# EAGLE design OpenEVSE_PLUS_v4 (EAGLE 7.3.0)
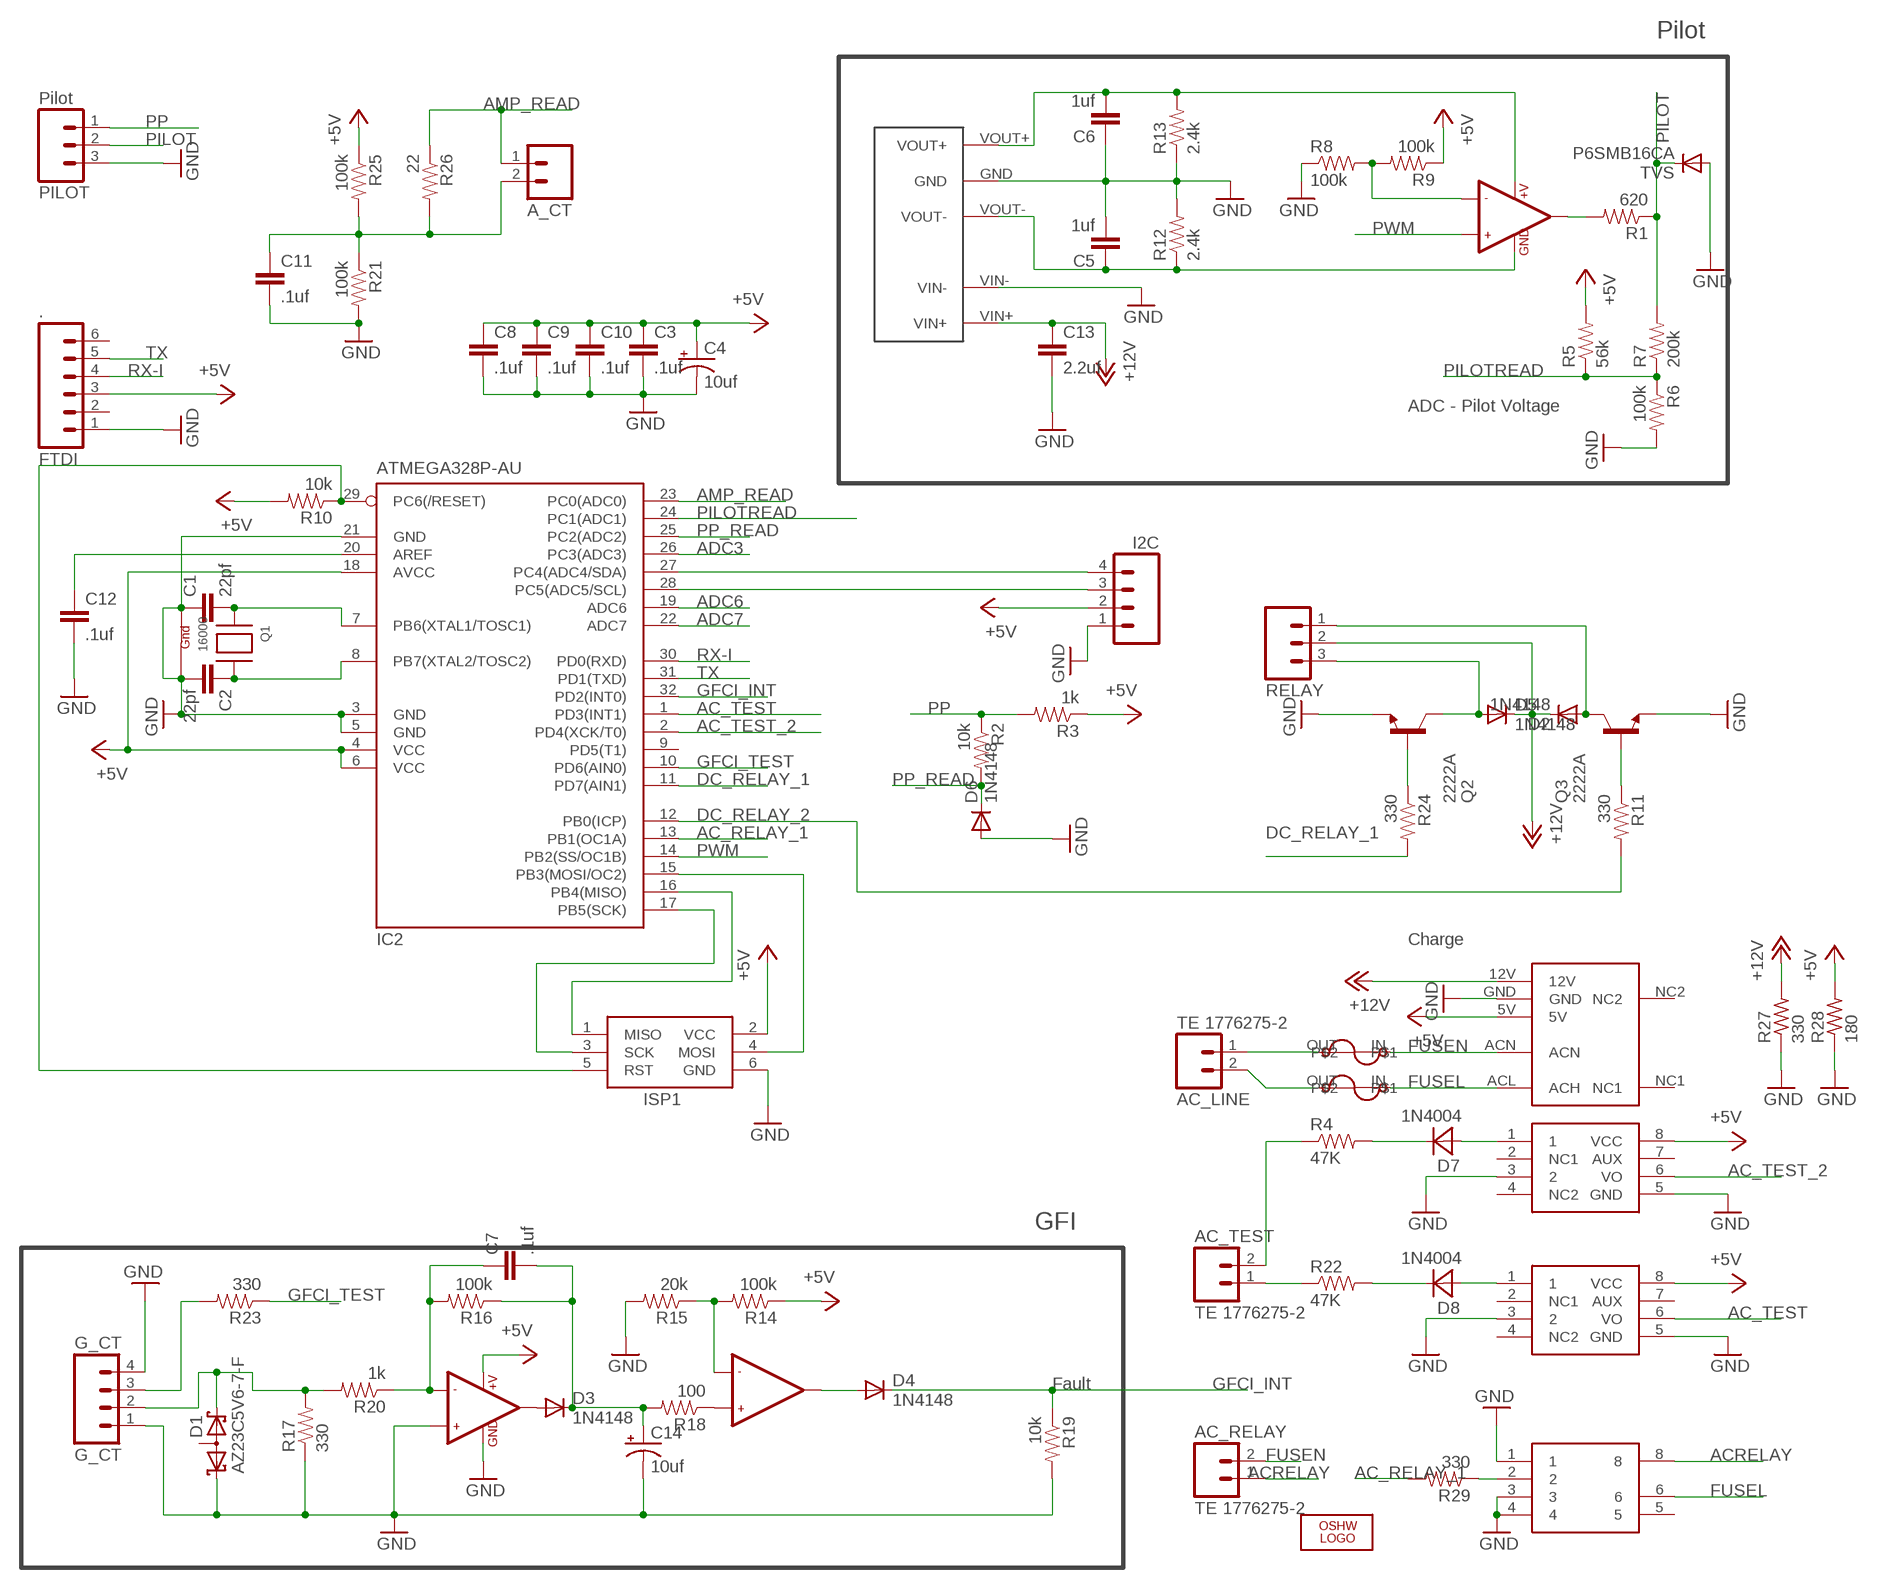
[diagram p0: schematic, sheet 1]

## Parts
.  FTDI  M06LOCK  [1X06_LOCK]
A_CT  M02PTH  [1X02]
AC_LINE  TE 1776275-2  M023.5MM_LOCK  [SCREWTERMINAL-3.5MM-2_LOCK]
AC_RELAY  TE 1776275-2  M023.5MM_LOCK  [SCREWTERMINAL-3.5MM-2_LOCK]
AC_TEST  TE 1776275-2  M023.5MM_LOCK  [SCREWTERMINAL-3.5MM-2_LOCK]
C1  22pf  CAP0805  [0805]
C2  22pf  CAP0805  [0805]
C3  .1uf  CAP0805  [0805]
C4  10uf  CAP_POL1206  [EIA3216]
C5  1uf  CAP0805  [0805]
C6  1uf  CAP0805  [0805]
C7  .1uf  CAP0805  [0805]
C8  .1uf  CAP0805  [0805]
C9  .1uf  CAP0805  [0805]
C10  .1uf  CAP0805  [0805]
C11  .1uf  CAP0805  [0805]
C12  .1uf  CAP0805  [0805]
C13  2.2uf  CAP0805  [0805]
C14  10uf  CAP_POL1206  [EIA3216]
D1  AZ23C5V6-7-F  BAS40-06  [SOT23]
D2  1N4148  DIODE-SOD123  [SOD123]
D3  1N4148  DIODE-SOD123  [SOD123]
D4  1N4148  DIODE-SOD123  [SOD123]
D5  1N4148  DIODE-SOD123  [SOD123]
D6  1N4148  DIODE-SOD123  [SOD123]
D7  1N4004  MBRA340T3  [SMA]
D8  1N4004  MBRA340T3  [SMA]
DCDC  MD112D-12E  DCDC_SIP  [DCDC_SIP]
F1  BEL1AFUSE  [BELFUSE1A]
F2  BEL1AFUSE  [BELFUSE1A]
G_CT  G_CT  M04LOCK  [1X04_LOCK]
I2C  M04LOCK  [1X04_LOCK]
IC1  MID400  [DIP08]
IC2  ATMEGA328P-AU  MEGA8-AI  [TQFP32-08]
IC3  LM358  LMV358  [SO08]
IC4  LF353  LMV358  [SO08]
IC5  AQH1213  [DIP7]
IC6  MID400  [DIP08]
ISP1  AVRISP-6  [AVRISP]
LOGO1  OSHW_LOGO_8MILX0150-NT  [OSHW_8X150_NOTEXT]
PILOT  Pilot  M03SCREW_LOCK  [SCREWTERMINAL-3.5MM-3_LOCK.007S]
Q1  16000  XTAL-4-3225  [NX3225]
Q2  2222A  BCX70SMD  [SOT23]
Q3  2222A  BCX70SMD  [SOT23]
R1  620  RESISTOR0805-RES  [0805]
R2  10k  RESISTOR0805-RES  [0805]
R3  1k  RESISTOR0805-RES  [0805]
R4  47K  RESISTORPTH-1/4W  [AXIAL-0.4]
R5  56k  RESISTOR0805-RES  [0805]
R6  100k  RESISTOR0805-RES  [0805]
R7  200k  RESISTOR0805-RES  [0805]
R8  100k  RESISTOR0805-RES  [0805]
R9  100k  RESISTOR0805-RES  [0805]
R10  10k  RESISTOR0805-RES  [0805]
R11  330  RESISTOR0805-RES  [0805]
R12  2.4k  RESISTOR0805-RES  [0805]
R13  2.4k  RESISTOR0805-RES  [0805]
R14  100k  RESISTOR0805-RES  [0805]
R15  20k  RESISTOR0805-RES  [0805]
R16  100k  RESISTOR0805-RES  [0805]
R17  330  RESISTOR0805-RES  [0805]
R18  100  RESISTOR0805-RES  [0805]
R19  10k  RESISTOR0805-RES  [0805]
R20  1k  RESISTOR0805-RES  [0805]
R21  100k  RESISTOR0805-RES  [0805]
R22  47K  RESISTORPTH-1/4W  [AXIAL-0.4]
R23  330  RESISTOR0805-RES  [0805]
R24  330  RESISTOR0805-RES  [0805]
R25  100k  RESISTOR0805-RES  [0805]
R26  22  RESISTOR0805-RES  [0805]
R27  330  R-US_R1206  [R1206]
R28  180  R-US_R1206  [R1206]
R29  330  RESISTOR0805-RES  [0805]
RELAY  M03SCREW_LOCK  [SCREWTERMINAL-3.5MM-3_LOCK.007S]
TVS  P6SMB16CA  DIODE-SMB  [SMB]
U$1  MPM-04E-1205  [MPM-04E-1205]

## Nets
12V: C6.2 DCDC.VOUT+ IC4.8(+V) R13.2
+5V: ..3 C3.1 C4.A(+) C8.1 C9.1 C10.1 I2C.2 IC1.8(VCC) IC2.4(VCC) IC2.6(VCC) IC2.18(AVCC) IC3.8(+V) IC6.8(VCC) ISP1.2(VCC) R3.1 R5.2 R9.1 R10.2 R14.1 R25.1 R28.2 U$1.5V
+12V: C13.1 D2.C D5.C DCDC.VIN+ R27.2 RELAY.2 U$1.12V
-12V: C5.1 DCDC.VOUT- IC4.4(GND) R12.1
AC_RELAY_1: IC2.13(PB1(OC1A)) R29.2
AC_TEST: IC2.1(PD3(INT1)) IC6.6(VO)
AC_TEST_2: IC1.6(VO) IC2.2(PD4(XCK/T0))
ACRELAY: AC_RELAY.1 IC5.8
ADC3: IC2.26(PC3(ADC3))
ADC6: IC2.19(ADC6)
ADC7: IC2.22(ADC7)
AMP_READ: A_CT.1 IC2.23(PC0(ADC0)) R26.1
DC_RELAY_1: IC2.11(PD7(AIN1)) R24.2
DC_RELAY_2: IC2.12(PB0(ICP)) R11.2
FUSEL: F2.IN IC5.6 U$1.ACL(ACH)
FUSEN: AC_RELAY.2 F1.IN U$1.ACN
GFCI_INT: D4.C IC2.32(PD2(INT0)) R19.1
GFCI_TEST: IC2.10(PD6(AIN0)) R23.1
GND: ..1 C1.1 C2.2 C3.2 C4.C(-) C5.2 C6.1 C8.2 C9.2 C10.2 C11.2 C12.2 C13.2 C14.C(-) D1.1(K1) D6.A DCDC.GND DCDC.VIN- G_CT.1 G_CT.4 I2C.1 IC1.3 IC1.5(GND) IC2.3(GND) IC2.5(GND) IC2.21(GND) IC3.3(+IN1) IC3.4(GND) IC5.1 IC5.3 IC5.4 IC6.3 IC6.5(GND) ISP1.6(GND) PILOT.3 Q1.1(G1) Q1.3(G2) Q2.2(E) Q3.2(E) R6.2 R8.1 R12.2 R13.1 R15.2 R17.1 R19.2 R21.2 R27.1 R28.1 TVS.A U$1.GND
N$1: D2.A Q3.3(C) RELAY.1
N$2: Q3.1(B) R11.1
N$4: C1.2 IC2.7(PB6(XTAL1/TOSC1)) Q1.2(X1)
N$5: C2.1 IC2.8(PB7(XTAL2/TOSC2)) Q1.4(X2)
N$6: D5.A Q2.3(C) RELAY.3
N$7: A_CT.2 C11.1 R21.1 R25.2 R26.2
N$8: C7.1 IC3.2(-IN1) R16.2 R20.1
N$9: D7.C R4.P$2
N$10: IC4.2(-IN1) R8.2 R9.2
N$11: IC4.1(OUT1) R1.2
N$12: AC_LINE.2 F2.OUT
N$13: AC_LINE.1 F1.OUT
N$14: IC2.15(PB3(MOSI/OC2)) ISP1.4(MOSI)
N$15: IC2.17(PB5(SCK)) ISP1.3(SCK)
N$16: IC2.16(PB4(MISO)) ISP1.1(MISO)
N$17: AC_TEST.2 R4.P$1
N$18: IC5.2 R29.1
N$19: D7.A IC1.1
N$20: D1.2(K2) G_CT.2 R17.2 R20.2
N$21: D3.A IC3.1(OUT1)
N$22: G_CT.3 R23.2
N$23: C7.2 C14.A(+) D3.C R16.1 R18.2
N$24: IC3.6(-IN2) R14.2 R15.1
N$25: D4.A IC3.7(OUT2)
N$26: IC3.5(+IN2) R18.1
N$27: D8.C R22.P$2
N$28: D8.A IC6.1
N$29: AC_TEST.1 R22.P$1
N$30: Q2.1(B) R24.1
N$39: I2C.4 IC2.27(PC4(ADC4/SDA))
N$40: I2C.3 IC2.28(PC5(ADC5/SCL))
N$44: C12.1 IC2.20(AREF)
PILOT: PILOT.2 R1.1 R7.2 TVS.C
PILOTREAD: IC2.24(PC1(ADC1)) R5.1 R6.1 R7.1
PP: PILOT.1 R2.1 R3.2
PP_READ: D6.C IC2.25(PC2(ADC2)) R2.2
PWM: IC2.14(PB2(SS/OC1B)) IC4.3(+IN1)
RST: IC2.29(PC6(/RESET)) ISP1.5(RST) R10.1
RX-I: ..4 IC2.30(PD0(RXD))
TX: ..5 IC2.31(PD1(TXD))
Unconnected: ..2 ..6 D1.3(AA) IC1.2(NC1) IC1.4(NC2) IC1.7(AUX) IC2.9(PD5(T1)) IC4.5(+IN2) IC4.6(-IN2) IC4.7(OUT2) IC5.5 IC6.2(NC1) IC6.4(NC2) IC6.7(AUX) U$1.NC1 U$1.NC2

## Notes on the sheet
- Pilot
- ADC - Pilot Voltage
- Charge
- GFI
- Fault

## Library data of the parts
. = SparkFun:M06: Header 6 Standard 6-pin 0.1" header. Use with straight break away headers (SKU : PRT-00116), right angle break away headers (PRT-00553), swiss pins (PRT-00743), machine pins (PRT-00117), and female headers (PRT-00115). Molex polarized connector foot print use with SKU : PRT-08094 with associated crimp pins and housings. NOTES ON THE VARIANTS LOCK and LOCK_LONGPADS... This footprint was designed to help hold the alignment of a through-hole component (i.e. 6-pin header) while soldering it into place. You may notice that each hole has been shifted either up or down by 0.005 of an inch from it's more standard position (which is a perfectly straight line). This slight alteration caused the pins (the squares in the middle) to touch the edges of the holes. Because they are alternating, it causes a "brace" to hold the component in place. 0.005 has proven to be the perfect amount of "off-center" position when using our standard breakaway headers. Although looks a little odd when you look at the bare footprint, once you have a header in there, the alteration is very hard to notice. Also, if you push a header all the way into place, it is covered up entirely on the bottom side. This idea of altering the position of holes to aid alignment will be further integrated into the Sparkfun Library for other footprints. It can help hold any component with 3 or more connection pins.
A_CT AC_LINE AC_RELAY AC_TEST = SparkFun:M02: Header 2 Standard 2-pin 0.1" header. Use with straight break away headers (SKU : PRT-00116), right angle break away headers (PRT-00553), swiss pins (PRT-00743), machine pins (PRT-00117), and female headers (PRT-00115). Molex polarized connector foot print use with SKU : PRT-08233 with associated crimp pins and housings.
C1-C3 C5-C13 = SparkFun:CAP: Capacitor Standard 0603 ceramic capacitor, and 0.1" leaded capacitor.
C4 C14 = SparkFun:CAP_POL: Capacitor Polarized These are standard SMD and PTH capacitors. Normally 10uF, 47uF, and 100uF in electrolytic and tantalum varieties. Always verify the external diameter of the through hole cap, it varies with capacity, voltage, and manufacturer. The EIA devices should be standard.
D1 = diode:BAS40-06: Silicon Schottky Diodes General-purpose diode for high-speed switching
D2-D6 TVS = diode:DIODE-: DIODE
D7 D8 = diode:MBRA340T3: Surface Mount Schottky Power Rectifier Source: http://www.onsemi.com/pub_link/Collateral/MBRA340T3-D.PDF
DCDC = Qxd:DCDC_SIP
F1 F2 = Qxd:BEL1AFUSE
G_CT I2C = SparkFun:M04: Header 4 Standard 4-pin 0.1" header. Use with straight break away headers (SKU : PRT-00116), right angle break away headers (PRT-00553), swiss pins (PRT-00743), machine pins (PRT-00117), and female headers (PRT-00115). Molex polarized connector foot print use with SKU : PRT-08231 with associated crimp pins and housings. 1MM SMD Version SKU: PRT-10208
IC1 IC6 = SparkFun:MID400
IC2 = atmel:MEGA8: MICROCONTROLLER 8 Kbytes FLASH, 1 kbytes SRAM, 512 bytes EEPROM, USART, 6-channel 10 bit ADC, 2-channel 8 bit ADC Pin compatible with Atmega48, ATMega88, ATMega168 Source: avr.lbr; MPN: ATMEGA8-16AU; OC_FARNELL: 9171371; OC_NEWARK: 73M8863
IC3 IC4 = SparkFun:LMV358
IC5 = SparkFun:AQH1213
ISP1 = adafruit:AVRISP: AVR ISP HEADER Standard 6 pin header for AVR programming
LOGO1 = ohw-logo:OSHW_LOGO_8MIL
PILOT RELAY = SparkFun:M03: Header 3 Standard 3-pin 0.1" header. Use with straight break away headers (SKU : PRT-00116), right angle break away headers (PRT-00553), swiss pins (PRT-00743), machine pins (PRT-00117), and female headers (PRT-00115). Molex polarized connector foot print use with SKU : PRT-08232 with associated crimp pins and housings.
Q1 = adafruit:XTAL-4: Classic 4-pin 3.2 x 2.5mm crystal
Q2 Q3 = transistor-npn:BCX70*: NPN Transistor
R1-R26 R29 = SparkFun:RESISTOR: Resistor Basic schematic elements and footprints for 0603, 1206, and PTH resistors.
R27 R28 = rcl:R-US_: RESISTOR, American symbol
U$1 = Qxd:MPM-04E-1205

## Board
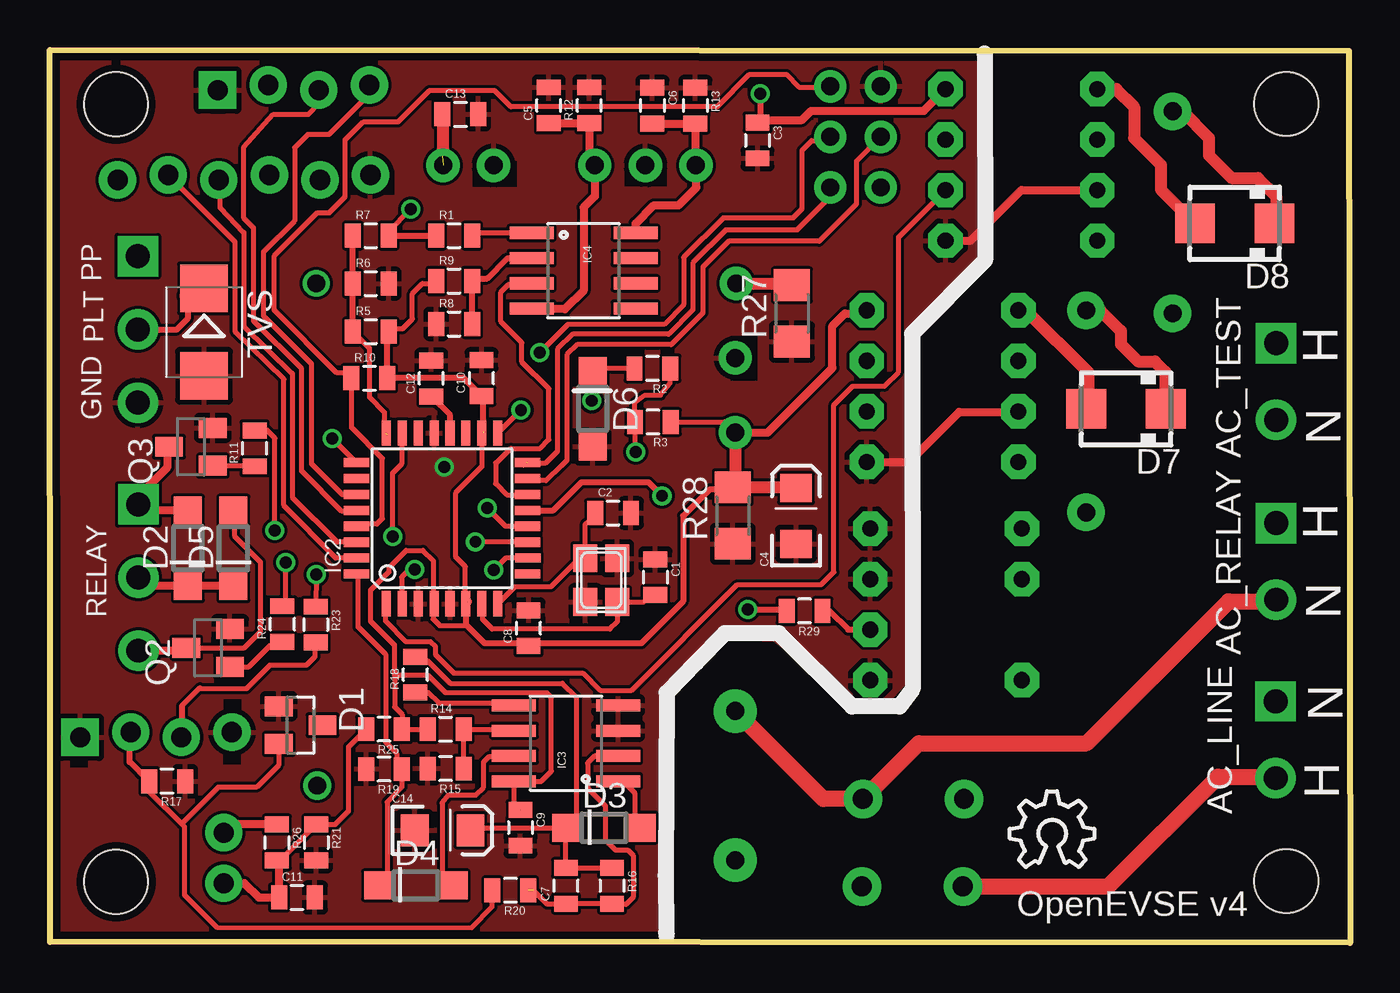
[diagram p1: board, top side]
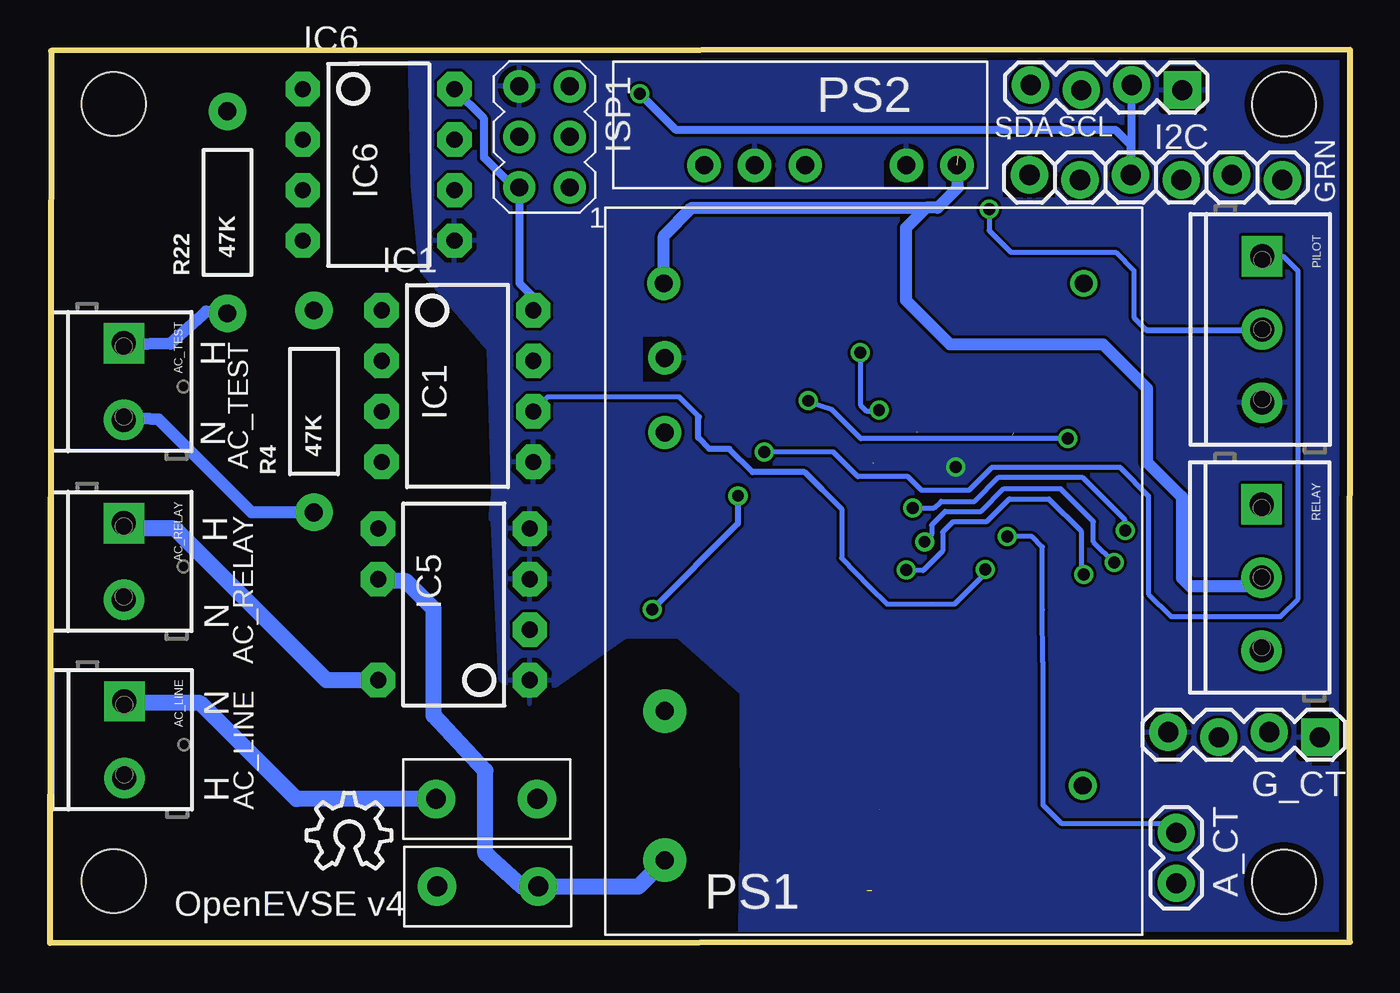
[diagram p2: board, bottom side, seen from below]

Size 65.35 x 44.9 mm. Coordinates in mm from the lower left corner, seen from the top.
Outline: 65.27,44.85 65.35,0 0.02,0.05 0,44.9 65.27,44.85
Copper layers (1*16): Top 0.0356mm / dielectric 1.5011mm / Bottom 0.0356mm
Design rules "default": minimum track width 6mil, minimum drill 13mil, track to track 6mil, track to pad 6mil, pad to pad 6mil, via to via 6mil, smd to smd 6mil, copper to edge 15mil, drill to drill 6mil, minimum pad ring 7mil, minimum via ring 7mil, stop-mask expansion 4mil, vias tented up to drill 0mil, thermal gap 10mil
Holes 3.2 mm at 62.13,42.18 62.14,3.11 3.33,3.07 3.33,42.16
tRestrict: area 4.1,26 to 4.8,28.4; area 8.1,41.7 to 8.8,44; area 1,8.8 to 1.9,10.2; area 14.9,37.6 to 17.3,38.8; area 21.3,38 to 23.5,39.3; area 28.9,38 to 31,39.3; area 34.2,28.3 to 35.5,30.5; area 8.7,9 to 9.6,10.3; area 8.7,10.9 to 9.6,12.2
bRestrict: area 4.1,26 to 4.8,28.4; area 8.1,41.7 to 8.7,44.1; area 1,8.9 to 1.9,10.1; area 14.8,37.5 to 17.4,38.8; area 21.2,38 to 23.4,39.3; area 28.9,37.9 to 31,39.3; area 34.2,28.2 to 35.5,30.5; area 8.7,9 to 9.6,10.2; area 1.1,11 to 2,12.1; area 1.1,11 to 2,12.1

### Footprints (pad centres in the part's own frame; a part is rotated, then mirrored left to right if it is on the bottom)
1X06_LOCK = drill 1.016 pad 1.88: 1 0,0; 2 2.54,-0.254; 3 5.08,0; 4 7.62,-0.254; 5 10.16,0; 6 12.7,-0.254
1X02 = drill 1.016 pad 1.88: 1 0,0; 2 2.54,0
SCREWTERMINAL-3.5MM-2_LOCK = drill 1.2 pad 2.032 square: 1 -0.178,0 | drill 1.2 pad 2.032: 2 3.678,0
0805 = smd 0.8 x 1.2: 1 -0.9,0; 2 0.9,0
EIA3216 = smd 1.4 x 1.6: A 1.4,0; C -1.4,0
SOT23 = smd 1 x 1.4: 1 -0.95,-1.1; 2 0.95,-1.1; 3 0,1.1
SOD123 = smd 1.4 x 1.4: A 1.9,0; C -1.9,0
SMA = smd 2 x 2: A 2,0; C -2,0
DCDC_SIP = drill 0.9 pad 1.676: GND 10.16,0; VIN+ 0,0; VIN- 2.54,0; VOUT+ 12.7,0; VOUT- 7.62,0
BELFUSE1A = drill 1 pad 1.93: IN 2,1.66; OUT 2,6.74
1X04_LOCK = drill 1.016 pad 1.88 square: 1 0,0.127 | drill 1.016 pad 1.88: 2 2.54,-0.127; 3 5.08,0.127; 4 7.62,-0.127
DIP08 = drill 0.813 pad 1.727 octagon: 1 -3.81,-3.81; 2 -1.27,-3.81; 3 1.27,-3.81; 4 3.81,-3.81; 5 3.81,3.81; 6 1.27,3.81; 7 -1.27,3.81; 8 -3.81,3.81
TQFP32-08 = smd 1.27 x 0.457: 1 -4.293,2.8; 2 -4.293,2; 3 -4.293,1.2; 4 -4.293,0.4; 5 -4.293,-0.4; 6 -4.293,-1.2; 7 -4.293,-2; 8 -4.293,-2.8; 17 4.293,-2.8; 18 4.293,-2; 19 4.293,-1.2; 20 4.293,-0.4; 21 4.293,0.4; 22 4.293,1.2; 23 4.293,2; 24 4.293,2.8 | smd 0.457 x 1.27: 9 -2.8,-4.293; 10 -2,-4.318; 11 -1.2,-4.293; 12 -0.4,-4.293; 13 0.4,-4.293; 14 1.2,-4.293; 15 2,-4.293; 16 2.8,-4.293; 25 2.8,4.293; 26 2,4.293; 27 1.2,4.293; 28 0.4,4.293; 29 -0.4,4.293; 30 -1.2,4.293; 31 -2,4.293; 32 -2.8,4.293
SO08 = smd 0.61 x 2.21: 1 -1.905,-2.616; 2 -0.635,-2.616; 3 0.635,-2.616; 4 1.905,-2.616; 5 1.905,2.616; 6 0.635,2.616; 7 -0.635,2.616; 8 -1.905,2.616
DIP7 = drill 0.813 pad 1.727 octagon: 1 -3.81,-3.81; 2 -1.27,-3.81; 3 1.27,-3.81; 4 3.81,-3.81; 5 3.81,3.81; 6 1.27,3.81; 8 -3.81,3.81
AVRISP = drill 0.9 pad 1.626: 1 -1.27,2.54; 2 1.27,2.54; 3 -1.27,0; 4 1.27,0; 5 -1.27,-2.54; 6 1.27,-2.54
SCREWTERMINAL-3.5MM-3_LOCK.007S = drill 1.2 pad 2.032 square: 1 -0.178,0 | drill 1.2 pad 2.032: 2 3.5,0; 3 7.178,0
NX3225 = smd 1.4 x 1.2: 1 -1.1,0.8; 2 1.1,0.8; 3 1.1,-0.8; 4 -1.1,-0.8
AXIAL-0.4 = drill 0.9 pad 1.88: P$1 -5.08,0; P$2 5.08,0
R1206 = smd 1.6 x 1.803: 1 -1.422,0; 2 1.422,0
SMB = smd 2.4 x 2.4: A 2.2,0; C -2.2,0
MPM-04E-1205 = drill 0.9 pad 1.676: 5V 3,25.25; 12V 2.95,32.75; GND 3,29 | drill 0.9 pad 2.184: ACL 3,3.75; ACN 3,11.25 | drill 0.9 pad 1.422: NC1 24,7.5 | drill 0.9: NC2 24.05,32.75

### Placement (x,y rotation side)
.  16.11,38.61 0 bottom
A_CT  8.74,5.54 270 bottom
AC_LINE  61.6,11.96 270 bottom
AC_RELAY  61.63,20.93 270 bottom
AC_TEST  61.63,29.97 270 bottom
C1  30.43,18.38 270 top
C2  28.31,21.62 0 top
C3  35.57,40.34 270 top
C4  37.5,21.46 90 top
C5  25.07,42.11 90 top
C6  30.28,42.09 270 top
C7  25.94,2.87 90 top
C8  24.06,15.82 90 top
C9  23.65,5.79 270 top
C10  21.7,28.4 90 top
C11  12.43,2.29 0 top
C12  19.17,28.37 90 top
C13  20.63,41.66 0 top
C14  19.74,5.66 0 top
D1  12.6,10.95 270 top
D2  6.94,19.84 90 top
D3  27.84,5.79 0 top
D4  18.39,2.9 0 top
D5  9.23,19.84 90 top
D6  27.28,26.85 270 top
D7  54.08,26.85 180 top
D8  59.54,36.17 180 top
DCDC  19.77,39.09 180 bottom
F1  39.2,5.23 90 bottom
F2  39.15,0.84 90 bottom
G_CT  1.53,10.46 180 bottom
I2C  8.44,43 180 bottom
IC1  44.86,27.99 270 bottom
IC2  19.71,21.35 90 top
IC3  25.94,10.03 90 top
IC4  26.82,33.79 270 top
IC5  45.04,17.02 90 bottom
IC6  48.82,39.12 270 bottom
ISP1  40.49,40.52 180 bottom
LOGO1  48.24,3.81 0 top
LOGO2  OSHW_LOGO_8MILX0150-NT  [OSHW_8X150_NOTEXT]  52.43,3.73 0 bottom
PILOT  4.42,34.34 270 bottom
Q1  27.72,18.24 270 top
Q2  7.96,14.83 90 top
Q3  7.09,24.94 90 top
R1  20.32,35.56 0 top
R2  30.28,28.88 180 top
R3  30.31,26.19 180 top
R4  52.08,26.72 90 bottom
R5  16.13,30.73 0 top
R6  16.13,33.15 0 top
R7  16.13,35.56 0 top
R8  20.32,31.12 0 top
R9  20.32,33.27 0 top
R10  16.06,28.39 0 top
R11  10.29,24.86 90 top
R12  27.11,42.11 90 top
R13  32.44,42.09 270 top
R14  19.89,10.74 0 top
R15  19.89,8.76 180 top
R16  28.25,2.87 270 top
R17  5.9,8.13 180 top
R18  18.37,13.49 90 top
R19  16.79,8.74 180 top
R20  23.14,2.64 180 top
R21  13.39,5.05 270 top
R22  56.42,36.73 90 bottom
R23  13.37,16 270 top
R24  11.69,16.03 90 top
R25  16.79,10.74 180 top
R26  11.41,5.05 270 top
R27  37.29,31.65 90 top
R28  34.32,21.49 90 top
R29  37.93,16.69 180 top
RELAY  4.45,21.87 270 bottom
TVS  7.75,30.71 270 top
U$1  37.44,0.41 0 bottom

### Tracks (layer width: path | path; a pad name or v marks a point on that pad's centre or on a via)
12V
  Top 0.254: 32.47,41.17 32.38,41.25 R13.2
  Top 0.305: 32.47,41.17 32.31,41.27
  Top 0.406: C6.2 R13.2 32.47,41.17 DCDC.VOUT+ 32.49,39.06 32.49,37.97 31.6,37.08 30.36,37.08 29.44,36.17 IC4.8
+5V  (via drill 0.6)  (3 unrouted)
  Top 0.254: R5.2 17.03,30.88 17.73,30.88 18.22,31.37 18.22,32.64 18.73,33.15 19.49,33.15 19.49,33.21 R9.1 | 21.77,25.7 IC2.18 21.71,23.94 20.38,22.61 20.38,19.43 20.88,18.92 20.88,17.02 | 23.65,6.68 23.32,7.01 IC3.8 24.72,8.13 24.72,8.15 25.2,8.64 25.2,12.34 24.97,12.57 19.89,12.57 19.03,13.44 17.53,13.44 17.51,13.41 17.4,13.51 | 21.01,16.64 21.01,16.95 IC2.6 | 17.4,13.51 17.33,13.59 | 17.33,13.44 17.33,14.96 16.11,16.18 16.11,17.73 17.05,18.67 17.05,18.87 17.91,19.74 18.75,19.74 19.26,19.23 19.26,16.46 | 17.33,13.44 17.4,13.51 | 31.17,26.37 R3.1 33.91,26.19 U$1.5V | C8.1 24.06,14.99 24.14,15.06 | 19.26,17.11 IC2.4 19.31,16.51 19.26,16.46 | 19.26,16.46 19.26,16.28 19.59,15.95 20.91,15.95 20.93,15.98 | 17.33,13.44 17.33,11.86 17.71,11.48 17.71,10.76 R25.1 R14.1
  Top 0.305: 20.95,17.01 IC2.6 20.93,17.03 20.93,15.98 21.85,15.06 24.14,15.06 29.72,15.06 31.83,17.17 31.83,21.46 33.18,22.81 34.22,22.81 R28.2 | R5.2 16.96,30.66 R10.2 20.8,28.39 C10.1 21.77,27.42 21.77,25.65 | v35.69,42.7 35.69,41.37 C3.1
  Top 0.406: IC2.6 21.01,17.15 | 21.01,17.14 20.88,17.02 | 35.69,41.37 37.79,41.37 38.26,41.83 43.92,41.83 IC6.8 | U$1.5V 36.08,25.66 39.32,28.91 39.32,31.01 39.96,31.65 40.9,31.65 IC1.8
  Top 0.61: C4.A 37.28,22.91 R28.2 34.45,23.04 U$1.5V
  Bottom 0.406: I2C.2 11,43.13 11,38.64 ..3 11.03,40.11 11.79,40.87 33.86,40.87 v35.69,42.7 | IC1.8 41.05,32.46 41.74,33.15 41.74,37.96 ISP1.2 42.03,37.98 43.52,39.47 43.52,41.43 IC6.8
+12V  (1 unrouted)
  Top 0.254: C13.1 19.73,41.57 19.82,41.43
  Top 0.406: 19.82,41.43 19.64,41.81 19.74,41.91 | D5.C D2.C 4.88,17.94 RELAY.2
  Top 0.61: U$1.12V 36.8,33.16 R27.2 | DCDC.VIN+ 19.77,41.62 C13.1
  Bottom 0.61: U$1.12V 34.49,35.54 33.08,36.96 21.32,36.96 | 19.77,39.6 19.72,39.55 19.72,37.97 20.73,36.96 21.32,36.96 | 21.32,36.96 22.33,35.94 22.33,32.31 20.12,30.1 12.43,30.1 10.22,27.89 10.22,24.18 8.46,22.43 8.46,18.34 8.06,17.94 4.88,17.94 RELAY.2
-12V
  Top 0.254: 27.04,41.21 R12.1
  Top 0.305: 27.04,41.21 27.11,41.27 R12.1
  Top 0.406: C5.1 R12.1 27.11,39.37 DCDC.VOUT- 27.39,37.54 26.83,36.98 26.83,32.79 25.89,31.85 24.24,31.85 IC4.4
AC_RELAY_1  (via drill 0.6)
  Top 0.305: IC2.13 25.31,21.75 26.73,23.17 30.08,23.17 v30.77,22.48 | v35.08,16.76 36.9,16.76 R29.2
  Bottom 0.305: v30.77,22.48 30.77,21.08 v35.08,16.76
AC_TEST
  Top 0.254: IC2.1 16.87,17.01 16.87,16.18 17.91,15.14 19.13,15.14 19.39,14.88 19.39,14.48 20.3,13.56 26.78,13.56 27.64,12.7 29.24,12.7 34.55,18.01 38.77,18.01 39.4,18.64 39.4,27.05 40.34,27.99 41.94,27.99 42.65,28.7 42.65,35.48 IC6.6
AC_TEST_2  (via drill 0.6)
  Top 0.254: v18.34,18.77 17.96,18.67 17.68,18.39 17.68,17.08 IC2.2
  Top 0.305: 17.67,17.01 IC2.2
  Bottom 0.254: 32.72,26.44 33.74,27.46 40.31,27.46 IC1.6 | 26.55,22.81 25.56,21.82 25.56,19.33 24.16,17.91 23.27,17.02 19.89,17.02 18.34,18.57 v18.34,18.77
  Bottom 0.305: 26.55,22.81 27.41,23.67 30.03,23.67 31.2,24.84 32.21,24.84 32.77,25.4 32.77,26.39 32.72,26.44
ACRELAY
  Bottom 0.813: IC5.8 51.44,13.21 59.06,20.83 61.35,20.83 AC_RELAY.1
AMP_READ  (via drill 0.6)
  Top 0.254: v17.23,20.42 17.23,23.62 17.71,24.11 IC2.23
  Top 0.406: R26.1 9.16,5.96 A_CT.1
  Bottom 0.254: v17.23,20.42 15.98,20.42 15.47,19.91 15.47,16.76 15.45,14.1 15.45,6.93 14.53,6.02 9.22,6.02 A_CT.1
DC_RELAY_1  (via drill 0.6)
  Top 0.254: IC2.11 21.41,20.14 v21.39,20.17 | R24.2 11.87,16.99 v11.87,19.13
  Bottom 0.254: v11.87,19.13 12.91,20.17 12.91,21.18 14.56,22.84 17.4,22.84 18.55,21.69 20.35,21.69 21.04,21.01 21.04,20.52 v21.39,20.17
DC_RELAY_2  (via drill 0.6)
  Top 0.254: IC2.12 22.9,20.95 v21.98,21.87 | v11.31,20.73 11.31,25.38 10.88,25.81 10.34,25.81 R11.2
  Bottom 0.254: v21.98,21.87 20.91,21.87 20.55,22.2 18.88,22.2 17.66,23.42 13.47,23.42 11.33,21.29 11.33,20.75 v11.31,20.73
FUSEL
  Bottom 0.813: U$1.ACL 35.76,2.84 F2.IN 41.63,2.84 43.46,4.5 43.46,8.66 46.05,11.43 46.05,16.79 47.45,18.19 48.75,18.19 IC5.6
FUSEN
  Top 0.813: U$1.ACN 38.87,7.23 F1.IN 40.87,7.23 43.67,10.03 52.1,10.03 59.24,17.17 61.54,17.17 AC_RELAY.2
GFCI_INT
  Top 0.254: 16.9,2.89 D4.C | 15.4,18.52 IC2.32 15.5,18.46 15.5,15.87 16.87,14.5 16.87,10.08 17.43,9.52 17.43,9 R19.1 17.7,7.83 16.95,7.09 16.95,3.35 D4.C | 16.72,3.12 D4.C
GFCI_TEST  (via drill 0.6)
  Top 0.254: IC2.10 22.91,19.35 v22.31,18.75 | v13.39,18.52 R23.1
  Bottom 0.254: v22.31,18.75 22.28,18.72 21.47,18.72 20.48,19.71 20.48,20.65 19.94,21.18 18.27,21.18 17.12,22.33 15.14,22.33 13.52,20.7 13.52,18.64 v13.39,18.52
GND  (via drill 0.6)
  Top 0.254: C14.C 18.72,5.26
  Top 0.406: IC6.5 46.28,35.31 48.82,37.85 IC6.3 | IC1.5 43.19,24.18 45.7,26.7 48.65,26.7 IC1.3
  other vias: 19.82,23.93
  pour Bottom: -0.12,45.28 47.27,44.59 47.1,38.1 46.72,33.88 43.29,29.85 43.06,22.5 43.21,21.34 43.11,21.54 43.08,21.18 42.7,13.28 41.23,12.04 36.44,15.4 33.77,15.44 30.59,12.6 30.56,5 30.63,3.02 30.66,-0.02 29.96,0.06 17.99,0.16 7.64,-0.14 0.15,-0.09
  pour Top: 0.1,45.07 4.1,45.35 46.79,44.84 47.09,44.3 47.1,34.26 43.41,30.58 43.41,30.45 43.06,30.2 42.91,13.08 41.97,12.04 40.7,12.04 36.43,15.24 33.94,15.34 30.66,12.37 30.66,3.86 30.79,0.27 24.93,0.28 -0.16,-0.02 0.1,28.81
N$1
  Top 0.406: D2.A 4.76,21.74 RELAY.1 4.45,22.45 5.92,23.93 5.92,24.87 Q3.3
N$2
  Top 0.254: Q3.1 10.26,23.99 R11.1
N$4
  Top 0.254: C1.2 29.83,17.14 Q1.2 28.52,16.14 28.15,15.77 22.23,15.77 21.75,16.26 21.75,17.02 IC2.7
N$5
  Top 0.254: Q1.4 26.92,21.07 27.23,21.34 27.23,21.44 C2.1 | Q1.4 27.01,19.21 | Q1.4 26.5,19.21 26.48,19.21 25.18,17.91 23.37,17.91 IC2.8
N$6
  Top 0.254: Q2.3 9.78,14.83 10.6,15.65 10.6,19.13 9.3,20.42 9.3,21.03 9.62,21.35
  Top 0.305: 9.62,21.35 D5.A
  Top 0.406: RELAY.3 6.71,14.69 Q2.3
N$7
  Top 0.254: R26.2 11.59,4.16 R21.1 14.34,5.96 15.02,6.63 15.02,9.87 R25.2
  Top 0.406: A_CT.2 9.78,3 10.49,2.29 C11.1 11.53,4.04 R26.2
N$8  (1 unrouted)
  Top 0.254: R16.2 C7.1 | 28.23,1.85 28.23,1.95 R16.2 | 25.9,1.93 C7.1 | 24.29,2.64 24.97,1.96 25.92,1.96 C7.1 | IC3.2 27.39,9.4 27.03,9.04 27.03,7.77 27.92,6.88 27.92,5.18 28.43,4.67 29.04,4.67 29.32,4.39 29.32,2.29 28.96,1.93 28.29,1.93 R16.2
N$9
  Top 0.61: 55.99,26.94 D7.C 56.06,26.87 56.06,28.7 55.53,29.23 54.69,29.23 53.83,30.1 53.83,30.76 52.79,31.8 R4.P$2
N$10
  Top 0.305: 20.97,30.73 R8.2 R9.2 21.09,33.4 21.97,33.4 23,34.43 IC4.2
N$11
  Top 0.254: IC4.1 21.36,35.7 R1.2
N$12
  Top 0.813: F2.OUT 53.19,2.84 58.7,8.36 61.53,8.36 AC_LINE.2
N$13
  Bottom 0.813: F1.OUT 52.96,7.23 57.79,12.06 61.52,12.06 AC_LINE.1
N$14
  Top 0.254: 24.03,23.37 IC2.15 24.11,23.24 24.95,23.24 25.71,23.98 25.99,24.26 25.99,29.57 26.5,30.07 31.22,30.07 32.82,31.67 32.82,33.98 34.12,35.28 38.66,35.28 40.54,37.16 40.54,39.31 ISP1.4
N$15  (via drill 0.6)
  Top 0.254: IC2.17 v23.68,26.8 | v24.62,29.67 26.04,31.09 30.87,31.09 31.86,32.08 31.86,34.47 33.84,36.45 37.34,36.45 37.8,36.91 37.8,39.85 38.28,40.34 39.03,40.34 ISP1.3
  Bottom 0.254: v24.62,29.67 24.62,27.05 24.31,26.75 23.73,26.75 v23.68,26.8
N$16  (1 unrouted)
  Top 0.254: 24.26,24.13 24.13,24.26 IC2.16 24.04,24.11 24.9,24.11 25.51,24.71 25.51,29.85 26.27,30.61 31.09,30.61 32.31,31.83 32.31,34.19 33.96,35.84 37.55,35.84 39.07,37.36 39.07,37.83 ISP1.1 | 23.93,24.13 23.8,24
N$17
  Bottom 0.61: R4.P$1 55.2,21.64 59.87,26.31 61.6,26.42 AC_TEST.2
N$18
  Top 0.305: R29.1 39.17,16.69 40.11,15.75 IC5.2
N$19
  Top 0.61: IC1.1 49.08,31.8 52.18,28.7 52.18,26.94 D7.A
N$20
  Top 0.254: R17.2 5,7.61 6.62,5.98 | 6.62,5.98 6.76,5.84 6.76,2.41 8.39,0.79 21.21,0.76 22.23,1.8 22.23,2.63 R20.2 | D1.2 11.5,8.93 10.39,7.82 8.46,7.82 6.62,5.98
  Top 0.305: R17.2 4.02,9.09 4.02,10.54 G_CT.2
N$21
  Top 0.254: IC3.1 28.81,8.13 29.39,7.54 29.39,6.14 D3.A
N$22
  Top 0.254: 6.63,11.91 7.55,12.83 7.6,12.78 9.89,12.78 11.08,13.97 12.91,13.97 13.34,14.4 13.34,15.08 R23.2
  Top 0.305: 6.63,11.91 6.63,10.36 G_CT.3
N$23
  Top 0.254: 28.23,4.01 28.48,3.76 28.48,3.63 28.34,3.77 R16.1 C7.2 25.94,5.42 D3.C | C14.A 21.24,5.66 21.37,5.79 25.81,5.79 | 25.81,5.79 25.94,5.66 | 25.81,5.79 D3.C | D3.C 25.82,5.66 25.81,5.66 26.45,6.04 26.45,12.37 25.76,13.06 20.12,13.06 19,14.17 18.58,14.17 R18.2 18.28,14.39 18.24,14.43 | 18.24,14.43 18.19,14.43 | 18.24,14.43 18.7,14.43 18.83,14.3
N$24
  Top 0.254: R15.1 R14.2 23.25,10.74 IC3.6
N$25
  Top 0.254: D4.A 19.72,3.42 19.72,7.04 20.05,7.44 21.42,7.44 21.8,7.82 21.8,9.09 22.08,9.37 23.3,9.37 IC3.7
N$26
  Top 0.254: IC3.5 23.2,12.06 19.54,12.06 19.03,12.57 18.38,12.57 R18.1 18.43,12.52
N$27
  Top 0.61: R22.P$2 56.9,41.81 58.25,40.46 58.25,39.6 59.39,38.46 60.71,38.46 61.63,37.54 61.63,36.25 D8.C
N$28
  Top 0.61: IC6.1 53.6,42.93 54.49,42.04 54.49,40.46 55.83,39.12 55.83,37.88 D8.A
N$29
  Bottom 0.61: R22.P$1 57.48,31.75 59.29,30.12 61.42,30.07 AC_TEST.1
N$30
  Top 0.254: Q2.1 10,13.88 11.05,14.93 11.5,14.93 R24.1
N$39
  Top 0.254: IC2.27 14.72,22.52 13.16,24.08 13.16,29.11 10.75,31.52 10.75,34.75 12.3,36.3 12.3,39.98 12.96,40.64 14.03,40.64 16.06,42.67 I2C.4
N$40
  Top 0.254: IC2.28 14.68,21.69 12.65,23.72 12.65,28.88 10.24,31.27 10.24,35.94 9.76,36.45 9.76,40 11.23,41.66 13.01,41.66 13.52,42.19 I2C.3
N$44
  Top 0.305: IC2.20 20.11,26.53 C12.1
PILOT  (via drill 0.6)
  Top 0.254: R7.2 17.03,35.77 v18.14,36.88
  Top 0.305: R7.2 R1.1 | 6.93,32.53 6.93,31.38 6.35,30.81 4.46,30.81 PILOT.2
  Top 0.406: 17.07,35.73 R7.2
  Top 0.813: TVS.C 6.93,32.53
  Bottom 0.254: v18.14,36.88 18.14,35.81 17.05,34.72 11.79,34.72 10.88,33.81 10.88,31.45 10.24,30.81
  Bottom 0.305: 10.24,30.81 4.46,30.81 PILOT.2
PILOTREAD  (1 unrouted)
  Top 0.254: 16.95,25.53 16.82,25.53 16.82,26.67 16.06,27.43 16.06,29.91 R5.1
  Top 0.305: R7.1 R6.1 R5.1
PP  (via drill 0.6)
  Top 0.254: v29.44,24.69 29.41,24.73 R3.2 29.41,27.17 29.9,27.53 30.69,27.53 31.17,28.14 31.17,28.69 R2.1
  Bottom 0.254: PILOT.1 4.4,34.49 3.33,34.49 2.62,33.78 2.62,17.3 3.51,16.41 9,16.41 10.14,17.55 10.14,22.48 11.56,23.9 18.01,23.9 19.16,22.76 21.54,22.76 22.23,23.44 24.75,23.44 25.99,24.69 v29.44,24.69
PP_READ  (via drill 0.6)
  Top 0.254: R2.2 27.46,28.88 D6.C 27.23,28.95 v27.23,27.25 | IC2.25 15.43,24.12 v14.2,25.35
  Bottom 0.254: v14.2,25.35 24.59,25.35 26.07,26.82 27.16,27.18 v27.23,27.25
PWM
  Top 0.254: IC4.3 24.15,33.1 23.04,33.1 22.66,32.71 22.66,31.24 23.73,30.18 23.73,29.21 25.07,27.86 25.07,25.3 24.64,24.87 23.17,24.87 22.43,24.13 22.41,24.13 22.41,23.09 22.97,22.53 23.99,22.53 IC2.14
RST
  Top 0.254: R10.1 15.17,28.38 15.17,25.91 16.72,24.36 16.72,21.34 16.44,21.06 15.53,21.06 IC2.29 | R10.1 15.16,28.44 15.17,28.45 | R10.1 | R10.1 14.87,28.68 14.41,28.68 11.26,31.83 11.26,34.52 13.44,36.7 14.05,36.7 14.84,37.52 14.84,40.39 15.75,41.27 17.51,41.27 19.08,42.85 22.36,42.85 23.17,42.04 33.53,42.04 35.16,43.66 37.01,43.66 37.65,43.03 39.19,43.03 ISP1.5
RX-I
  Top 0.254: IC2.30 14.46,20.14 12.2,22.4 12.2,28.63 9.76,31.01 9.76,35.71 8.56,36.96 8.56,38.28 ..4
TX
  Top 0.254: IC2.31 14.37,19.35 11.77,22 11.77,28.35 9.33,30.71 9.3,30.73 9.3,35.25 9,35.55 9,35.56 ..5

### Text on the board
tNames: PP | PLT | H | GND | AC_TEST | N | _ | _ | H | RELAY | N | AC_RELAY | N | AC_LINE | H | _ | _ | OpenEVSE v4
bNames: PS2 | SCL | SDA | IC6 | GRN | AC_TEST | H | IC1 | N | AC_RELAY | H | N | AC_LINE | N | H | PS1 | OpenEVSE v4